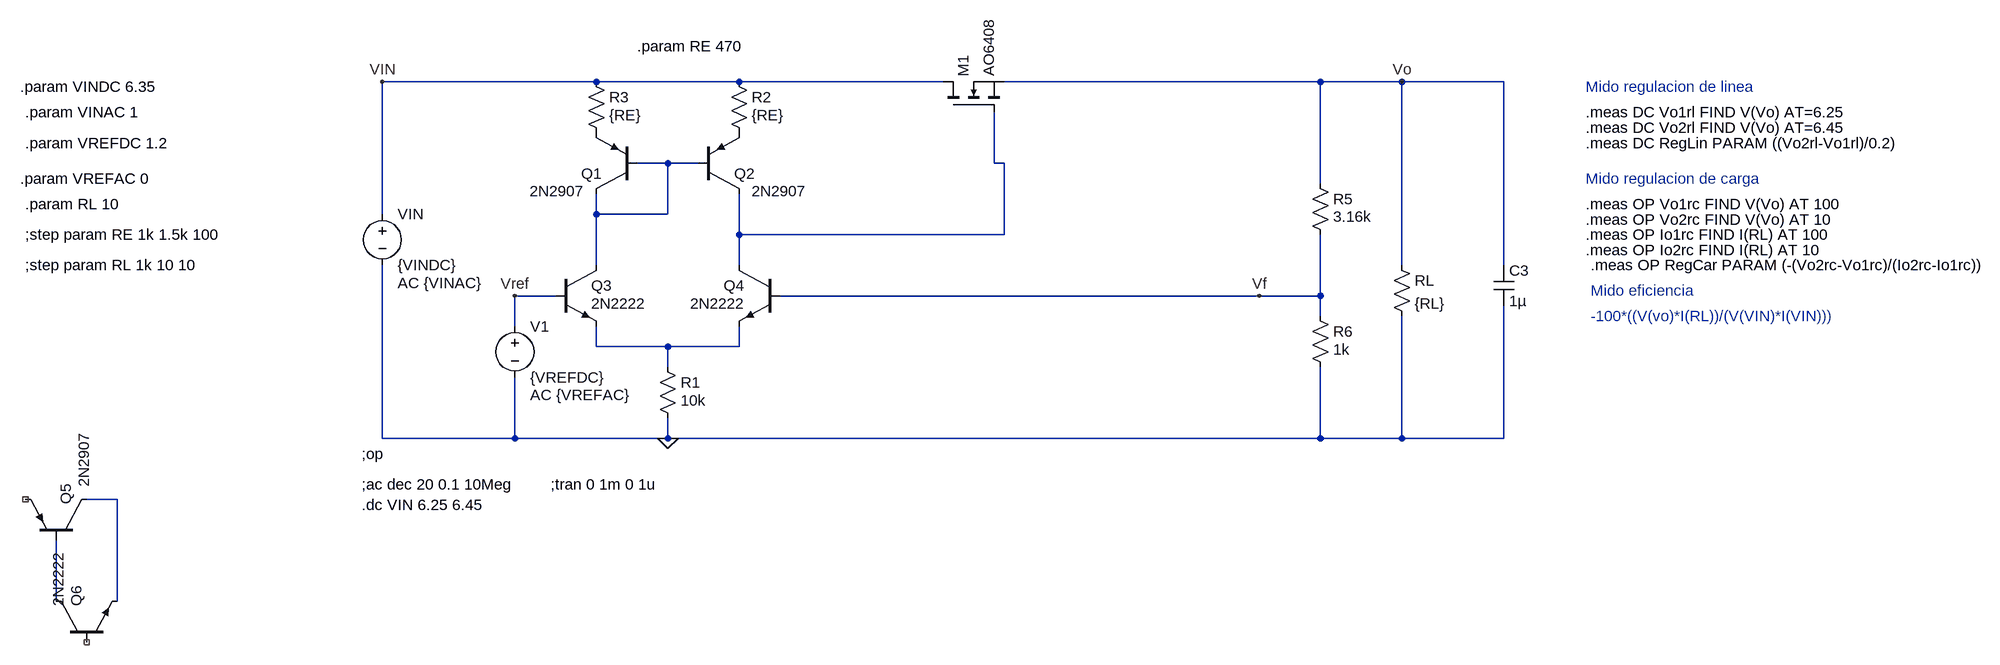
[diagram p0: schematic Regulador_LDOA_v1_MOSFET.asc]
Regulador_LDOA_v1_MOSFET.asc, the LTspice schematic file:
Version 4
SHEET 1 2316 856
WIRE -2208 -384 -2544 -384
WIRE -1984 -384 -2208 -384
WIRE -1664 -384 -1984 -384
WIRE -1072 -384 -1568 -384
WIRE -944 -384 -1072 -384
WIRE -784 -384 -944 -384
WIRE -2096 -256 -2144 -256
WIRE -2048 -256 -2096 -256
WIRE -1584 -256 -1584 -336
WIRE -1568 -256 -1584 -256
WIRE -1072 -224 -1072 -384
WIRE -2544 -176 -2544 -384
WIRE -2208 -176 -2208 -208
WIRE -2096 -176 -2096 -256
WIRE -2096 -176 -2208 -176
WIRE -1984 -144 -1984 -208
WIRE -1568 -144 -1568 -256
WIRE -1568 -144 -1984 -144
WIRE -2208 -96 -2208 -176
WIRE -1984 -96 -1984 -144
WIRE -944 -96 -944 -384
WIRE -784 -96 -784 -384
WIRE -2272 -48 -2336 -48
WIRE -1168 -48 -1920 -48
WIRE -1072 -48 -1072 -144
WIRE -1072 -48 -1168 -48
WIRE -1072 -16 -1072 -48
WIRE -2336 0 -2336 -48
WIRE -2208 32 -2208 0
WIRE -2096 32 -2208 32
WIRE -1984 32 -1984 0
WIRE -1984 32 -2096 32
WIRE -2096 64 -2096 32
WIRE -2544 176 -2544 -96
WIRE -2336 176 -2336 80
WIRE -2336 176 -2544 176
WIRE -2096 176 -2096 144
WIRE -2096 176 -2336 176
WIRE -1072 176 -1072 64
WIRE -1072 176 -2096 176
WIRE -944 176 -944 -16
WIRE -944 176 -1072 176
WIRE -784 176 -784 -32
WIRE -784 176 -944 176
WIRE -2960 272 -3008 272
WIRE -3056 432 -3056 336
WIRE -2960 432 -2960 272
FLAG -2096 176 0
FLAG -944 -384 Vo
FLAG -2336 -48 Vref
FLAG -2544 -384 VIN
FLAG -1168 -48 Vf
DATAFLAG -1104 -384 ""
DATAFLAG -1680 -48 ""
SYMBOL pnp -2144 -208 R180
WINDOW 3 84 4 Left 2
SYMATTR Value 2N2907
SYMATTR InstName Q1
SYMBOL pnp -2048 -208 M180
WINDOW 3 84 4 Left 2
SYMATTR Value 2N2907
SYMATTR InstName Q2
SYMBOL npn -2272 -96 R0
WINDOW 3 56 60 Left 2
SYMATTR Value 2N2222
SYMATTR InstName Q3
SYMBOL npn -1920 -96 M0
WINDOW 3 56 60 Left 2
SYMATTR Value 2N2222
SYMATTR InstName Q4
SYMBOL res -2112 48 R0
WINDOW 3 36 68 Left 2
SYMATTR Value 10k
SYMATTR InstName R1
SYMBOL pnp -3008 336 M270
WINDOW 3 84 4 Left 2
SYMATTR Value 2N2907
SYMATTR InstName Q5
SYMBOL npn -3056 496 R270
WINDOW 3 56 4 Left 2
SYMATTR Value 2N2222
SYMATTR InstName Q6
SYMBOL res -1088 -240 R0
WINDOW 3 36 68 Left 2
SYMATTR Value 3.16k
SYMATTR InstName R5
SYMBOL res -1088 -32 R0
WINDOW 3 36 68 Left 2
SYMATTR Value 1k
SYMATTR InstName R6
SYMBOL res -960 -112 R0
SYMATTR InstName RL
SYMATTR Value {RL}
SYMBOL voltage -2336 -16 R0
WINDOW 123 24 124 Left 2
WINDOW 39 0 0 Left 0
SYMATTR Value2 AC {VREFAC}
SYMATTR InstName V1
SYMATTR Value {VREFDC}
SYMBOL voltage -2544 -192 R0
WINDOW 123 24 124 Left 2
WINDOW 39 0 0 Left 0
SYMATTR Value2 AC {VINAC}
SYMATTR InstName VIN
SYMATTR Value {VINDC}
SYMBOL res -2224 -400 R0
WINDOW 3 36 68 Left 2
SYMATTR Value {RE}
SYMATTR InstName R3
SYMBOL res -2000 -400 R0
WINDOW 3 36 68 Left 2
SYMATTR Value {RE}
SYMATTR InstName R2
SYMBOL cap -800 -96 R0
SYMATTR InstName C3
SYMATTR Value 1µ
SYMBOL nmos -1664 -336 R270
SYMATTR InstName M1
SYMATTR Value AO6408
TEXT -2576 200 Left 2 !;op
TEXT -2576 248 Left 2 !;ac dec 20 0.1 10Meg
TEXT -3112 -376 Left 2 !.param VINDC 6.35
TEXT -3104 -336 Left 2 !.param VINAC 1
TEXT -3104 -288 Left 2 !.param VREFDC 1.2
TEXT -3112 -232 Left 2 !.param VREFAC 0
TEXT -3104 -192 Left 2 !.param RL 10
TEXT -2576 280 Left 2 !.dc VIN 6.25 6.45
TEXT -3104 -144 Left 2 !;step param RE 1k 1.5k 100
TEXT -2144 -440 Left 2 !.param RE 470
TEXT -3104 -96 Left 2 !;step param RL 1k 10 10
TEXT -656 -376 Left 2 ;Mido regulacion de linea
TEXT -656 -336 Left 2 !.meas DC Vo1rl FIND V(Vo) AT=6.25
TEXT -656 -312 Left 2 !.meas DC Vo2rl FIND V(Vo) AT=6.45
TEXT -656 -288 Left 2 !.meas DC RegLin PARAM ((Vo2rl-Vo1rl)/0.2)
TEXT -656 -232 Left 2 ;Mido regulacion de carga
TEXT -656 -192 Left 2 !.meas OP Vo1rc FIND V(Vo) AT 100
TEXT -656 -168 Left 2 !.meas OP Vo2rc FIND V(Vo) AT 10
TEXT -656 -144 Left 2 !.meas OP Io1rc FIND I(RL) AT 100
TEXT -656 -120 Left 2 !.meas OP Io2rc FIND I(RL) AT 10
TEXT -648 -56 Left 2 ;Mido eficiencia
TEXT -648 -16 Left 2 ;-100*((V(vo)*I(RL))/(V(VIN)*I(VIN)))
TEXT -648 -96 Left 2 !.meas OP RegCar PARAM (-(Vo2rc-Vo1rc)/(Io2rc-Io1rc))
TEXT -2280 248 Left 2 !;tran 0 1m 0 1u

The netlist it stands for:
* Regulador_LDOA_v1_MOSFET.asc
Q1 N001 N001 P001 0 2N2907
Q2 N002 N001 P002 0 2N2907
Q3 N001 Vref N003 0 2N2222
Q4 N002 Vf N003 0 2N2222
R1 N003 0 10k
Q5 N004 N005 NC_01 0 2N2907
Q6 N005 NC_02 N004 0 2N2222
R5 Vo Vf 3.16k
R6 Vf 0 1k
RL Vo 0 {RL}
V1 Vref 0 {VREFDC} AC {VREFAC}
VIN VIN 0 {VINDC} AC {VINAC}
R3 VIN P001 {RE}
R2 VIN P002 {RE}
C3 Vo 0 1µ
M1 VIN N002 Vo Vo AO6408
.model NPN NPN
.model PNP PNP
.lib standard.bjt
.model NMOS NMOS
.model PMOS PMOS
.lib standard.mos
;op
;ac dec 20 0.1 10Meg
.param VINDC 6.35
.param VINAC 1
.param VREFDC 1.2
.param VREFAC 0
.param RL 10
.dc VIN 6.25 6.45
;step param RE 1k 1.5k 100
.param RE 470
;step param RL 1k 10 10
* Mido regulacion de linea
.meas DC Vo1rl FIND V(Vo) AT=6.25
.meas DC Vo2rl FIND V(Vo) AT=6.45
.meas DC RegLin PARAM ((Vo2rl-Vo1rl)/0.2)
* Mido regulacion de carga
.meas OP Vo1rc FIND V(Vo) AT 100
.meas OP Vo2rc FIND V(Vo) AT 10
.meas OP Io1rc FIND I(RL) AT 100
.meas OP Io2rc FIND I(RL) AT 10
* Mido eficiencia
* -100*((V(vo)*I(RL))/(V(VIN)*I(VIN)))
.meas OP RegCar PARAM (-(Vo2rc-Vo1rc)/(Io2rc-Io1rc))
;tran 0 1m 0 1u
.backanno
.end